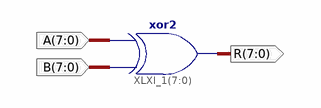
[diagram p0: schematic sheet 1]
// Xilinx ISE schematic XOR8Bit.sch (spartan6) as structural Verilog: 1 symbols, 3 ports
module XOR8Bit (
  input  [7:0] A,
  input  [7:0] B,
  output [7:0] R
);

  assign R = B ^ A;  // xor2 XLXI_1[7..0], 8 bits wide
endmodule
